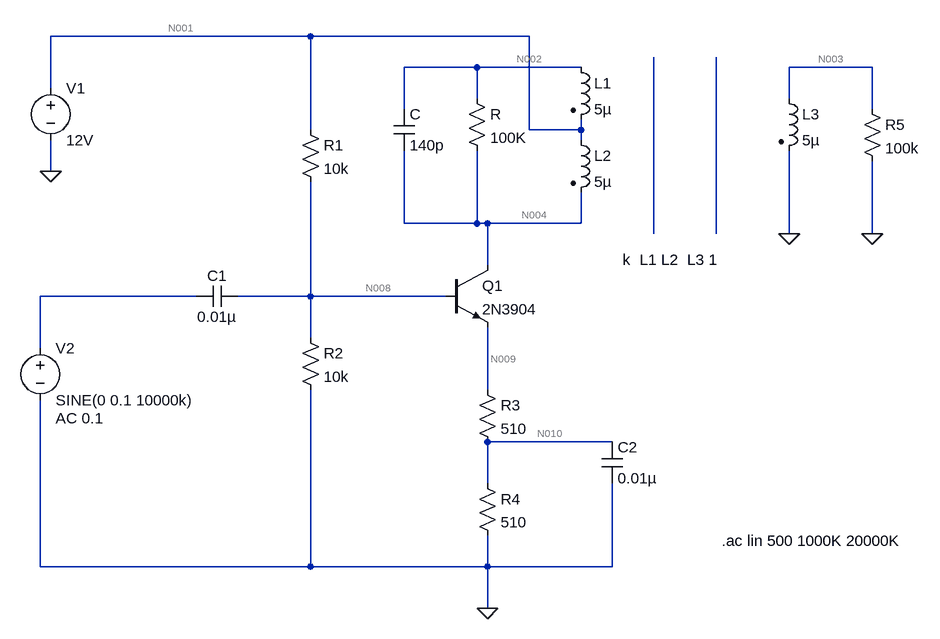
[diagram p0: schematic Draft1.asc]
Draft1.asc, the LTspice schematic file:
Version 4
SHEET 1 1408 836
WIRE 464 -64 64 -64
WIRE 800 -64 464 -64
WIRE 720 -16 608 -16
WIRE 880 -16 720 -16
WIRE 1328 -16 1200 -16
WIRE 64 16 64 -64
WIRE 720 32 720 -16
WIRE 1200 32 1200 -16
WIRE 608 48 608 -16
WIRE 1328 48 1328 -16
WIRE 464 80 464 -64
WIRE 800 80 800 -64
WIRE 880 80 880 64
WIRE 880 80 800 80
WIRE 880 96 880 80
WIRE 64 144 64 96
WIRE 608 224 608 112
WIRE 720 224 720 112
WIRE 720 224 608 224
WIRE 736 224 720 224
WIRE 880 224 880 176
WIRE 880 224 736 224
WIRE 992 240 992 -32
WIRE 1088 240 1088 -32
WIRE 1200 240 1200 112
WIRE 1328 240 1328 128
WIRE 736 288 736 224
WIRE 288 336 48 336
WIRE 464 336 464 160
WIRE 464 336 352 336
WIRE 672 336 464 336
WIRE 464 400 464 336
WIRE 48 416 48 336
WIRE 736 480 736 384
WIRE 928 560 736 560
WIRE 736 624 736 560
WIRE 48 752 48 496
WIRE 464 752 464 480
WIRE 464 752 48 752
WIRE 736 752 736 704
WIRE 736 752 464 752
WIRE 928 752 928 624
WIRE 928 752 736 752
WIRE 736 816 736 752
FLAG 64 144 0
FLAG 736 816 0
FLAG 1200 240 0
FLAG 1328 240 0
SYMBOL voltage 64 0 R0
SYMATTR InstName V1
SYMATTR Value 12V
SYMBOL res 448 64 R0
SYMATTR InstName R1
SYMATTR Value 10k
SYMBOL cap 592 48 R0
SYMATTR InstName C
SYMATTR Value 140p
SYMBOL res 704 16 R0
SYMATTR InstName R
SYMATTR Value 100K
SYMBOL cap 352 320 R90
WINDOW 0 0 32 VBottom 2
WINDOW 3 32 32 VTop 2
SYMATTR InstName C1
SYMATTR Value 0.01µ
SYMBOL res 448 384 R0
SYMATTR InstName R2
SYMATTR Value 10k
SYMBOL res 720 464 R0
SYMATTR InstName R3
SYMATTR Value 510
SYMBOL res 720 608 R0
SYMATTR InstName R4
SYMATTR Value 510
SYMBOL cap 912 560 R0
SYMATTR InstName C2
SYMATTR Value 0.01µ
SYMBOL npn 672 288 R0
SYMATTR InstName Q1
SYMATTR Value 2N3904
SYMBOL voltage 48 400 R0
WINDOW 123 24 124 Left 2
WINDOW 39 0 0 Left 0
SYMATTR Value2 AC 0.1
SYMATTR InstName V2
SYMATTR Value SINE(0 0.1 10000k)
SYMBOL res 1312 32 R0
SYMATTR InstName R5
SYMATTR Value 100k
SYMBOL ind2 864 -32 R0
SYMATTR InstName L1
SYMATTR Value 5µ
SYMATTR Type ind
SYMBOL ind2 864 80 R0
SYMATTR InstName L2
SYMATTR Value 5µ
SYMATTR Type ind
SYMBOL ind2 1184 16 R0
SYMATTR InstName L3
SYMATTR Value 5µ
SYMATTR Type ind
TEXT 944 280 Left 2 !k  L1 L2  L3 1
TEXT 1096 712 Left 2 !.ac lin 500 1000K 20000K

The netlist it stands for:
* Draft1.asc
V1 N001 0 12V
R1 N001 N008 10k
C N002 N004 140p
R N002 N004 100K
C1 N008 N007 0.01µ
R2 N008 0 10k
R3 N009 N010 510
R4 N010 0 510
C2 N010 0 0.01µ
Q1 N004 N008 N009 0 2N3904
V2 N007 0 SINE(0 0.1 10000k) AC 0.1
R5 N003 0 100k
L1 N002 N001 5µ
L2 N001 N004 5µ
L3 N003 0 5µ
.model NPN NPN
.model PNP PNP
.lib standard.bjt
k  L1 L2  L3 1
.ac lin 500 1000K 20000K
.backanno
.end

* Results of the author's LTspice run, read from the files saved beside the schematic
* Operating Point, zero values left out:
*   V(n001) = 12 V
*   V(n008) = 5.919 V
*   V(n002) = 12 V
*   V(n004) = 12 V
*   V(n009) = 5.222 V
*   V(n010) = 2.611 V
*   Ic(Q1) = 5.103 mA
*   Ib(Q1) = 16.23 µA
*   Ie(Q1) = -5.119 mA
*   I(L2) = 5.103 mA
*   I(R4) = 5.119 mA
*   I(R3) = 5.119 mA
*   I(R2) = 591.9 µA
*   I(R1) = 608.1 µA
*   I(V1) = -5.711 mA
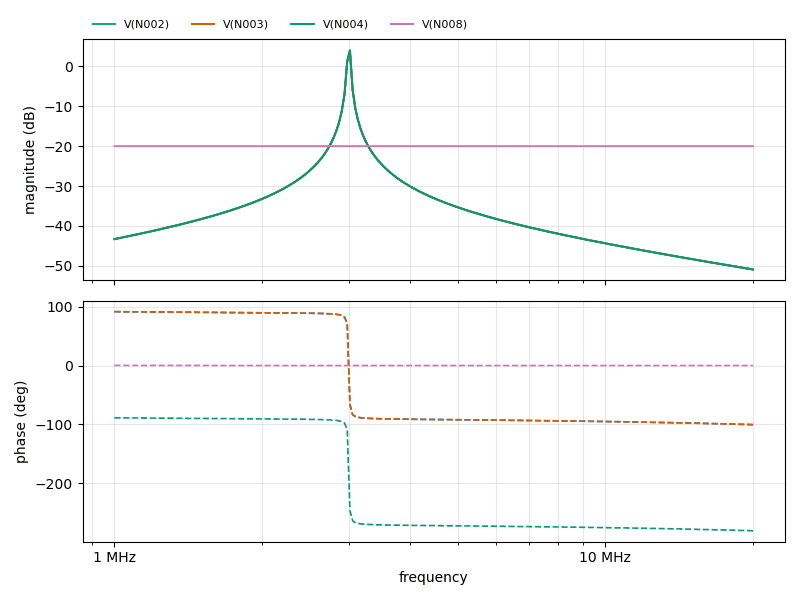
[diagram p1: AC Analysis of Draft1.asc, plotted from the saved traces]
* AC Analysis, 1 run:
*   V(N002): -43.32 dB at 1 MHz, -50.95 dB at 20 MHz, peak 4.03 dB at 3.018 MHz, 3 dB below the peak at 2.979 MHz and 3.03 MHz
*   V(N003): -43.32 dB at 1 MHz, -50.95 dB at 20 MHz, peak 4.03 dB at 3.018 MHz, 3 dB below the peak at 2.979 MHz and 3.03 MHz
*   V(N004): -43.32 dB at 1 MHz, -50.95 dB at 20 MHz, peak 4.03 dB at 3.018 MHz, 3 dB below the peak at 2.979 MHz and 3.03 MHz
*   V(N008): -20.00 dB at 1 MHz, -20.00 dB at 20 MHz, peak -20.00 dB at 20 MHz